# EAGLE design bucket (EAGLE 7.6.0)
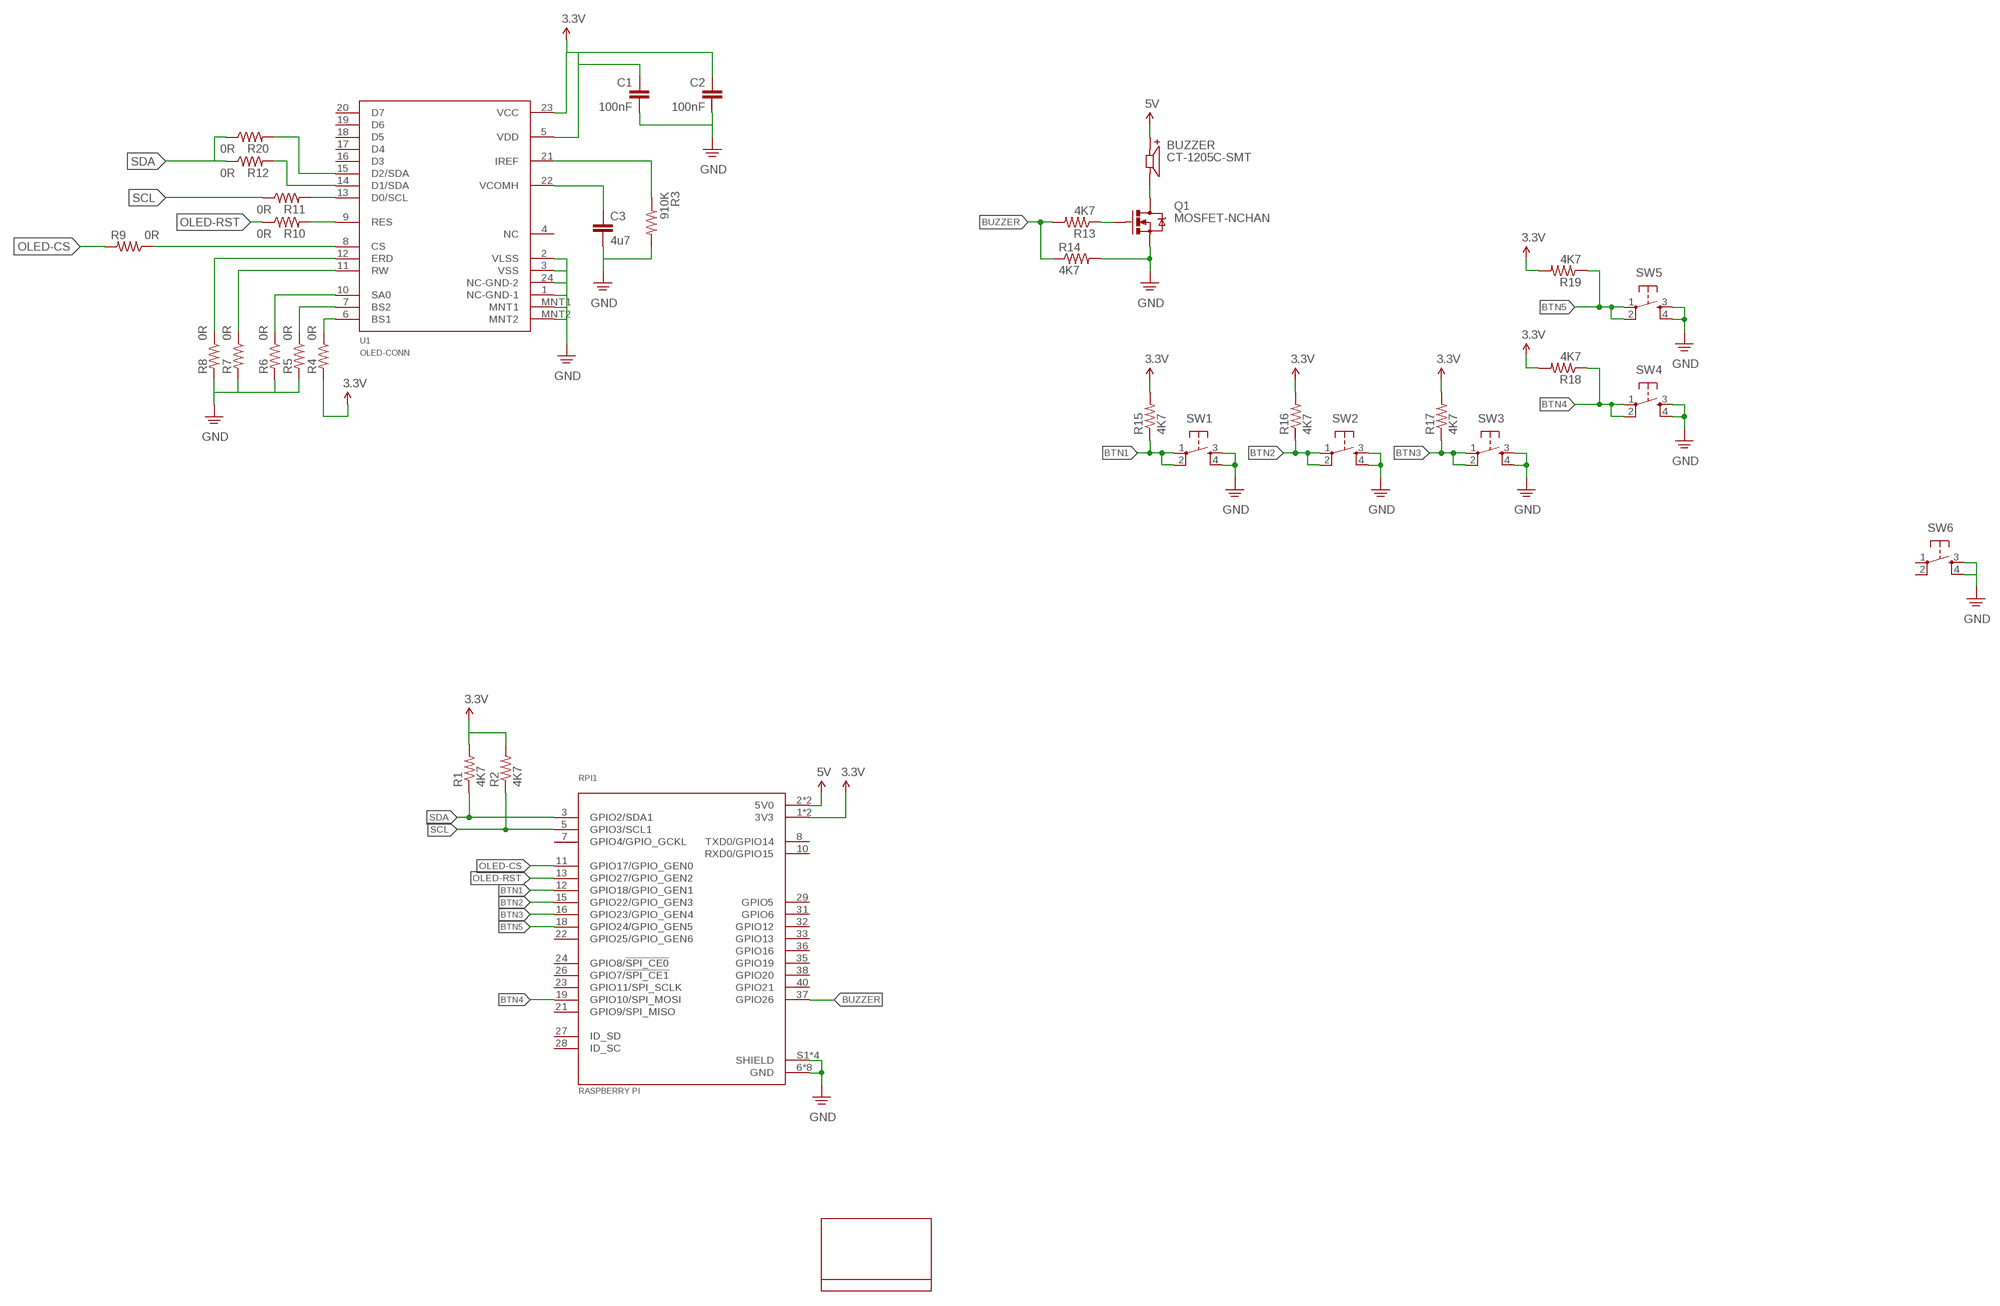
[diagram p0: schematic, sheet 1]

## Parts
BUZZER  CT-1205C-SMT  [CUI_CT-1205C-SMT]
C1  100nF  CAP0603-CAP  [0603-CAP]
C2  100nF  CAP0603-CAP  [0603-CAP]
C3  4u7  CAP0603-CAP  [0603-CAP]
Q1  MOSFET-NCHAN  MOSFET-NCHANNELSMD  [SOT23-3]
R1  4K7  RESISTOR0603-RES  [0603-RES]
R2  4K7  RESISTOR0603-RES  [0603-RES]
R3  910K  RESISTOR0603-RES  [0603-RES]
R4  0R  RESISTOR0603-RES  [0603-RES]
R5  0R  RESISTOR0603-RES  [0603-RES]
R6  0R  RESISTOR0603-RES  [0603-RES]
R7  0R  RESISTOR0603-RES  [0603-RES]
R8  0R  RESISTOR0603-RES  [0603-RES]
R9  0R  RESISTOR0603-RES  [0603-RES]
R10  0R  RESISTOR0603-RES  [0603-RES]
R11  0R  RESISTOR0603-RES  [0603-RES]
R12  0R  RESISTOR0603-RES  [0603-RES]
R13  4K7  RESISTOR0603-RES  [0603-RES]
R14  4K7  RESISTOR0603-RES  [0603-RES]
R15  4K7  RESISTOR0603-RES  [0603-RES]
R16  4K7  RESISTOR0603-RES  [0603-RES]
R17  4K7  RESISTOR0603-RES  [0603-RES]
R18  4K7  RESISTOR0603-RES  [0603-RES]
R19  4K7  RESISTOR0603-RES  [0603-RES]
R20  0R  RESISTOR0603-RES  [0603-RES]
RPI1  RASPBERRY PI  RASPBERRY_PI_3_MODEL_B+  [MODULE_RASPBERRY_PI_3_MODEL_B+]
SW1  TAC_SWITCHPTH  [TACTILE-PTH]
SW2  TAC_SWITCHPTH  [TACTILE-PTH]
SW3  TAC_SWITCHPTH  [TACTILE-PTH]
SW4  TAC_SWITCHPTH  [TACTILE-PTH]
SW5  TAC_SWITCHPTH  [TACTILE-PTH]
SW6  TAC_SWITCHPTH  [TACTILE-PTH]
U1  OLED-CONN  [CONN24_1X24_DRC_FFC_HIR]
U$1  OLED-PANEL-1.54IN  [OLED-1.54IN]

## Nets
3.3V: C1.1 C2.1 R1.2 R2.2 R4.2 R15.2 R16.2 R17.2 R18.2 R19.2 RPI1.1(3V3) RPI1.17(3V3) U1.5(VDD) U1.23(VCC)
5V: BUZZER.1 RPI1.2(5V0) RPI1.4(5V0)
BTN1: R15.1 RPI1.12(GPIO18/GPIO_GEN1) SW1.1 SW1.2
BTN2: R16.1 RPI1.15(GPIO22/GPIO_GEN3) SW2.1 SW2.2
BTN3: R17.1 RPI1.16(GPIO23/GPIO_GEN4) SW3.1 SW3.2
BTN4: R18.1 RPI1.19(GPIO10/SPI_MOSI) SW4.1 SW4.2
BTN5: R19.1 RPI1.18(GPIO24/GPIO_GEN5) SW5.1 SW5.2
BUZZER: R13.2 R14.1 RPI1.37(GPIO26)
GND: C1.2 C2.2 C3.2 Q1.2(S) R3.2 R5.2 R6.2 R7.2 R8.2 R14.2 RPI1.6(GND) RPI1.9(GND) RPI1.14(GND) RPI1.20(GND) RPI1.25(GND) RPI1.30(GND) RPI1.34(GND) RPI1.39(GND) RPI1.S1(SHIELD) RPI1.S2(SHIELD) RPI1.S3(SHIELD) RPI1.S4(SHIELD) SW1.3 SW1.4 SW2.3 SW2.4 SW3.3 SW3.4 SW4.3 SW4.4 SW5.3 SW5.4 SW6.3 SW6.4 U1.1(NC-GND-1) U1.2(VLSS) U1.3(VSS) U1.24(NC-GND-2) U1.MNT1 U1.MNT2
N$1: C3.1 U1.22(VCOMH)
N$2: R3.1 U1.21(IREF)
N$3: R4.1 U1.6(BS1)
N$4: R5.1 U1.7(BS2)
N$5: Q1.1(G) R13.1
N$6: BUZZER.2 Q1.3(D)
N$7: R6.1 U1.10(SA0)
N$8: R7.1 U1.11(RW)
N$9: R8.1 U1.12(ERD)
N$10: R9.1 U1.8(CS)
N$11: R10.2 U1.9(RES)
N$12: R11.2 U1.13(D0/SCL)
N$13: R12.2 U1.14(D1/SDA)
N$14: R20.2 U1.15(D2/SDA)
OLED-CS: R9.2 RPI1.11(GPIO17/GPIO_GEN0)
OLED-RST: R10.1 RPI1.13(GPIO27/GPIO_GEN2)
SCL: R2.1 R11.1 RPI1.5(GPIO3/SCL1)
SDA: R1.1 R12.1 R20.1 RPI1.3(GPIO2/SDA1)
Unconnected: RPI1.7(GPIO4/GPIO_GCKL) RPI1.8(TXD0/GPIO14) RPI1.10(RXD0/GPIO15) RPI1.21(GPIO9/SPI_MISO) RPI1.22(GPIO25/GPIO_GEN6) RPI1.23(GPIO11/SPI_SCLK) RPI1.24(GPIO8/!SPI_CE0!) RPI1.26(GPIO7/!SPI_CE1!) RPI1.27(ID_SD) RPI1.28(ID_SC) RPI1.29(GPIO5) RPI1.31(GPIO6) RPI1.32(GPIO12) RPI1.33(GPIO13) RPI1.35(GPIO19) RPI1.36(GPIO16) RPI1.38(GPIO20) RPI1.40(GPIO21) SW6.1 SW6.2 U1.4(NC) U1.16(D3) U1.17(D4) U1.18(D5) U1.19(D6) U1.20(D7)

## Library data of the parts
BUZZER = bucket:CT-1205C-SMT: 12.8 mm, 5 V, 90 dB, 2.4 kHz, Surface Mount (SMT), Driving Circuit, Magnetic Audio Indicator Buzzer; DESCRIPTION: 12.8 mm, 5 V, 90 dB, 2.4 kHz, Surface Mount (SMT), Driving Circuit, Magnetic Audio Indicator Buzzer; MF: CUI DEVICES; MP: CT-1205C-SMT; PACKAGE: None
C1-C3 = bucket:CAP: Capacitor Standard 0603 ceramic capacitor, and 0.1" leaded capacitor.
Q1 = bucket:MOSFET-NCHANNEL
R1-R20 = bucket:RESISTOR: Resistor Basic schematic elements and footprints for 0603, 1206, and PTH resistors.
RPI1 = bucket:RASPBERRY_PI_3_MODEL_B+: BCM2835 Raspberry Pi Model B+
SW1-SW6 = bucket:TAC_SWITCH: Momentary Switch Button commonly used for reset or general input. Spark Fun Electronics SKU : COM-00097
U1 = bucket:OLED-CONN
U$1 = bucket:OLED-PANEL

## Board
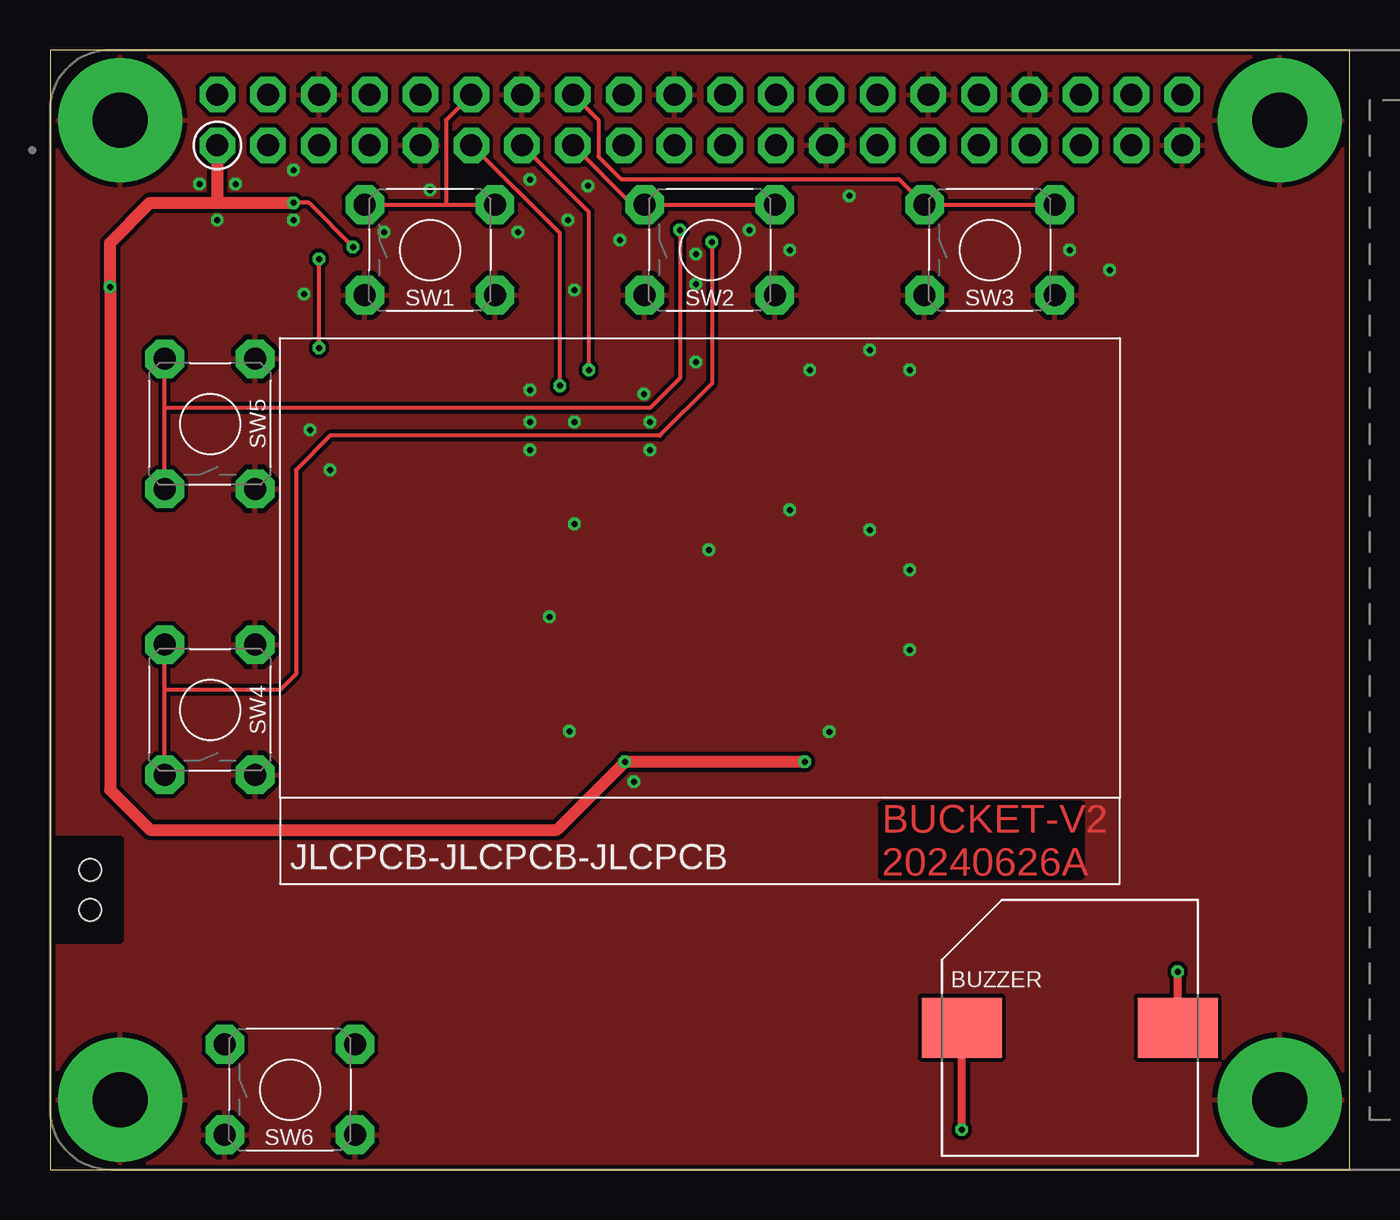
[diagram p1: board, top side]
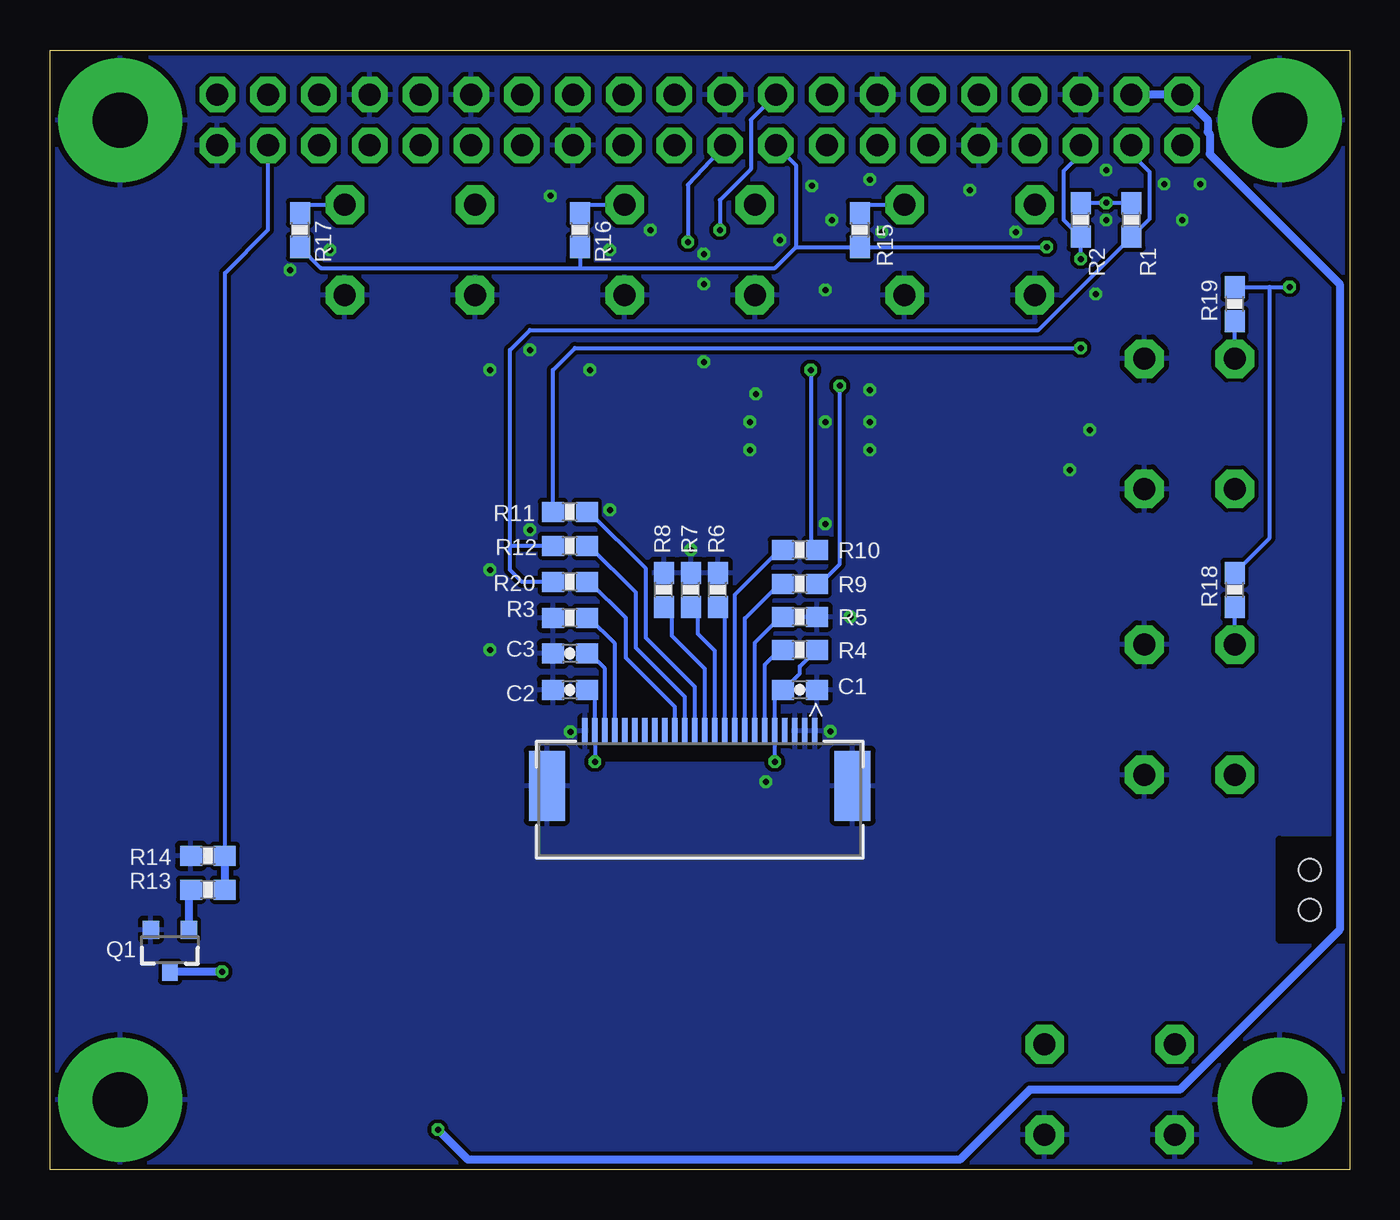
[diagram p2: board, bottom side, seen from below]

Size 65 x 56 mm. Coordinates in mm from the lower left corner, seen from the top.
Outline: 0,0 65,0 65,56 0,56 0,0
Copper layers (1*16): Top 0.035mm / dielectric 1.5mm / Bottom 0.035mm
Design rules "fusion-eagle-rule-tentedvias": minimum track width 6mil, minimum drill 0.3mm, track to track 6mil, track to pad 6mil, pad to pad 6mil, via to via 6mil, smd to smd 0mil, copper to edge 10mil, drill to drill 10mil, minimum pad ring 10mil, minimum via ring 6mil, stop-mask expansion 2mil, vias tented up to drill 25mil, thermal gap 10mil
Holes 1.1 mm at 2,13 2,15
tRestrict: area 0,11.5 to 3.5,16.5
bRestrict: area 0,11.5 to 3.5,16.5; 1 lines

### Footprints (pad centres in the part's own frame; a part is rotated, then mirrored left to right if it is on the bottom)
CUI_CT-1205C-SMT = smd 4 x 3: 1 5.4,0; 2 -5.4,0
0603-CAP = smd 1.1 x 1: 1 -0.85,0; 2 0.85,0
SOT23-3 = smd 0.8 x 0.9: 1 -0.95,-1; 2 0.95,-1; 3 0,1.1
0603-RES = smd 1.1 x 1: 1 -0.85,0; 2 0.85,0
MODULE_RASPBERRY_PI_3_MODEL_B+ = drill 1.1 pad 1.778 octagon: 1 -34.13,23.23; 2 -34.13,25.77; 3 -31.59,23.23; 4 -31.59,25.77; 5 -29.05,23.23; 6 -29.05,25.77; 7 -26.51,23.23; 8 -26.51,25.77; 9 -23.97,23.23; 10 -23.97,25.77; 11 -21.43,23.23; 12 -21.43,25.77; 13 -18.89,23.23; 14 -18.89,25.77; 15 -16.35,23.23; 16 -16.35,25.77; 17 -13.81,23.23; 18 -13.81,25.77; 19 -11.27,23.23; 20 -11.27,25.77; 21 -8.73,23.23; 22 -8.73,25.77; 23 -6.19,23.23; 24 -6.19,25.77; 25 -3.65,23.23; 26 -3.65,25.77; 27 -1.11,23.23; 28 -1.11,25.77; 29 1.43,23.23; 30 1.43,25.77; 31 3.97,23.23; 32 3.97,25.77; 33 6.51,23.23; 34 6.51,25.77; 35 9.05,23.23; 36 9.05,25.77; 37 11.59,23.23; 38 11.59,25.77; 39 14.13,23.23; 40 14.13,25.77 | drill 2.75 pad 6.2: S1 -39,24.5; S2 19,24.5; S3 19,-24.5; S4 -39,-24.5
TACTILE-PTH = drill 1.1 pad 1.93 octagon: 1 -3.251,2.261; 2 3.251,2.261; 3 -3.251,-2.261; 4 3.251,-2.261
CONN24_1X24_DRC_FFC_HIR = smd 0.254 x 1.295: 1 -5.75,-3.429; 2 -5.25,-3.429; 3 -4.75,-3.429; 4 -4.25,-3.429; 5 -3.75,-3.429; 6 -3.25,-3.429; 7 -2.75,-3.429; 8 -2.25,-3.429; 9 -1.75,-3.429; 10 -1.25,-3.429; 11 -0.75,-3.429; 12 -0.25,-3.429; 13 0.25,-3.429; 14 0.75,-3.429; 15 1.25,-3.429; 16 1.75,-3.429; 17 2.25,-3.429; 18 2.75,-3.429; 19 3.25,-3.429; 20 3.75,-3.429; 21 4.25,-3.429; 22 4.75,-3.429; 23 5.25,-3.429; 24 5.75,-3.429 | smd 1.803 x 3.5: MNT1 -7.645,-0.7; MNT2 7.645,-0.7

### Placement (x,y rotation side)
BUZZER  51,7.1 180 top
C1  27.5,24 0 bottom
C2  39,23.99 180 bottom
C3  39,25.81 180 bottom
Q1  59,11 180 bottom
R1  10.91,47.5 90 bottom
R2  13.45,47.5 90 bottom
R3  39,27.6 180 bottom
R4  27.5,26 0 bottom
R5  27.5,27.65 0 bottom
R6  31.6,29 90 bottom
R7  32.95,29 90 bottom
R8  34.3,29 90 bottom
R9  27.5,29.3 0 bottom
R10  27.5,31 180 bottom
R11  39,32.9 0 bottom
R12  39,31.2 0 bottom
R13  57.1,14 0 bottom
R14  57.1,15.7 180 bottom
R15  24.5,47 270 bottom
R16  38.5,47 270 bottom
R17  52.5,47 270 bottom
R18  5.74,29 90 bottom
R19  5.74,43.3 90 bottom
R20  39,29.4 0 bottom
RPI1  42.5,28 0 top
SW1  19,46 0 top
SW2  33,46 0 top
SW3  47,46 0 top
SW4  8,23 90 top
SW5  8,37.3 90 top
SW6  12,4 0 top
U1  32.5,18.5 180 bottom
U$1  32.5,30.1 0 top

### Tracks (layer width: path | path; a pad name or v marks a point on that pad's centre or on a via)
3.3V  (via drill 0.3)
  Top 0.203: v15.15,46.15 12.95,48.35 v12.18,48.35
  Top 0.61: v37.75,20.4 v28.75,20.4 25.35,17 5,17 3,19 v3,44.15 3,46.35 5,48.35 8.37,48.35 | 11.25,48.35 v12.18,48.35 8.37,48.35 | RPI1.1 8.37,48.35
  Bottom 0.203: C2.1 37.75,23.99 U1.23 v37.75,20.4 | v28.75,20.4 U1.5 28.75,24 C1.1 28.35,23.98 27.5,24.82 27.5,25.18 26.65,26.02 R4.2 | R2.2 v12.18,48.35 R1.2 | 27.7,46.15 R15.2 v15.15,46.15 | RPI1.17 27.7,50.24 27.7,46.15 | R17.2 51.45,45.1 38.5,45.1 | 38.5,45.1 28.75,45.1 27.7,46.15 | R16.2 38.5,45.1 | R18.2 4,31.59 4,44.15 | R19.2 4,44.15 | 4,44.15 v3,44.15
5V  (via drill 0.3)
  Top 0.406: v45.6,2 BUZZER.1
  Bottom 0.406: v45.6,2 44.1,0.5 19.5,0.5 16,4 8.5,4 0.5,12 0.5,44.3 7,50.8 7,51.8 7.1,51.9 7.1,52.5 RPI1.2 RPI1.4
BTN1
  Top 0.203: RPI1.12 19.8,52.5 19.8,48.26 | SW1.1 19.8,48.26 | SW1.2 20.1,48.26 19.8,48.26
  Bottom 0.203: R15.1 24.09,48.26 SW1.2
BTN2
  Top 0.203: SW2.2 SW2.1 29.12,48.26 RPI1.15
  Bottom 0.203: R16.1 38.09,48.26 SW2.2
BTN3
  Top 0.203: SW3.2 SW3.1 42.46,49.55 28.55,49.55 27.43,50.67 27.43,52.49 RPI1.16
  Bottom 0.203: R17.1 52.09,48.26 SW3.2
BTN4  (via drill 0.3)
  Top 0.203: v33.1,46.4 33.1,39.3 30.5,36.7 14,36.7 12.3,35 12.3,24.8 11.5,24 5.74,24 | SW4.1 5.74,24 | 5.74,24 SW4.2
  Bottom 0.203: RPI1.19 33.1,49.26 v33.1,46.4 | SW4.2 R18.1
BTN5  (via drill 0.3)
  Top 0.203: v31.5,47 31.5,39.6 30,38.1 5.74,38.1 | 5.74,38.1 SW5.2 | SW5.1 5.74,38.1
  Bottom 0.203: RPI1.18 29.95,52.51 29.95,50.05 31.5,48.5 v31.5,47 | SW5.2 R19.1
BUZZER
  Bottom 0.203: R14.1 56.25,44.85 54.09,47.01 RPI1.37
  Bottom 0.406: R13.2 R14.1
GND  (via drill 0.3)
  other vias: 41,32 37,33 32.95,31 24.98,27.65 25.98,21.93 38.98,21.9 24,49.52 19,49 23.4,46.9 25.9,47.5 28.5,46.5 37,46 51,46 53,45 12.7,43.8 12.18,47.5 12.18,50 9.28,49.3 7.47,49.3 39.98,48.7 34.98,47 29.7,38.8 30,36 24,36 24,39 14,35 13,37 29.2,19.4 30,37.4 24,37.4 26.23,32.3 26.23,37.4 26.23,44 32.3,45.8 32.3,44.3 32.3,40.4 26.9,49.2 16.7,46.9 8.37,47.5 41,41 38,40 43,40 43,26 43,30
  pour Top (isolate 0.203, rank 5): 0,0 65,0 65,56 0,56
  pour Bottom (isolate 0.203, rank 5): 0,0 65,0 65,56 0,56
N$1
  Bottom 0.203: U1.22 37.25,25.05 38.01,25.81 C3.1
N$2
  Bottom 0.203: U1.21 36.75,26.3 38.05,27.6 R3.1
N$3
  Bottom 0.203: U1.6 29.25,25.26 28.51,26 R4.1
N$4
  Bottom 0.203: U1.7 29.75,26.35 28.45,27.65 R5.1
N$5
  Bottom 0.406: Q1.1 58.05,14 R13.1
N$6  (via drill 0.3)
  Top 0.406: BUZZER.2 v56.4,9.9
  Bottom 0.406: v56.4,9.9 Q1.3
N$7
  Bottom 0.203: U1.10 31.25,28.15 R6.1
N$8
  Bottom 0.203: U1.11 31.75,25.95 32.6,26.8 32.6,28.15 R7.1
N$9
  Bottom 0.203: U1.12 32.25,25.05 33.9,26.7 33.9,28.15 R8.1
N$10
  Bottom 0.203: U1.8 30.25,27.56 28.51,29.3 R9.1
N$11
  Bottom 0.203: U1.9 30.75,28.76 28.51,31 R10.2
N$12
  Bottom 0.203: U1.13 32.75,24.15 35.2,26.6 35.2,30.05 38.05,32.9 R11.2
N$13
  Bottom 0.203: U1.14 33.25,23.65 35.7,26.1 35.7,28.87 38.03,31.2 R12.2
N$14
  Bottom 0.203: U1.15 33.75,23.15 36.2,25.6 36.2,27.6 38,29.4 R20.2
OLED-CS  (via drill 0.3)
  Top 0.203: v25.5,39.2 25.5,46.83 21.09,51.23 RPI1.11
  Bottom 0.203: R9.2 26.5,29.3 25.5,30.3 v25.5,39.2
OLED-RST  (via drill 0.3)
  Top 0.203: v26.95,40 26.95,47.89 RPI1.13
  Bottom 0.203: v26.95,40 26.95,31 R10.1
SCL  (via drill 0.3)
  Top 0.203: v13.45,41.1 v13.45,45.55
  Bottom 0.203: R11.1 39.85,40 38.75,41.1 v13.45,41.1 | v13.45,45.55 R2.1 14.3,47.5 14.3,49.95 13.45,50.8 RPI1.5
SDA
  Bottom 0.203: 41.59,31.2 R12.1 42,31.2 | R20.1 41.4,29.4 42,30 42,31.2 | RPI1.3 10.91,50.81 10,49.9 10,47.56 R1.1 15.56,42 41,42 42,41 42,32.1 42,31.2

### Text on the board
Top: BUCKET-V2 / 20240626A
tPlace: JLCPCB-JLCPCB-JLCPCB